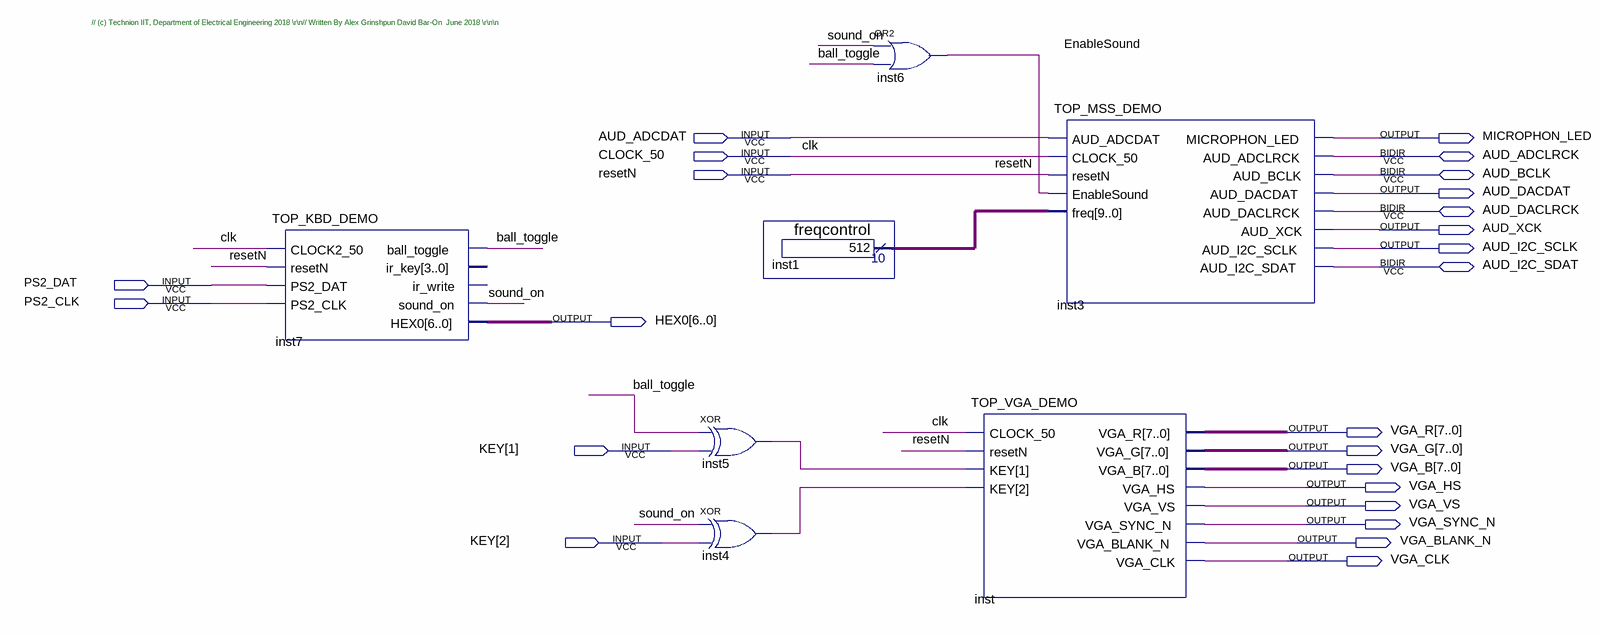
[diagram p0: schematic sheet]
// Quartus schematic TOP_Lab1_DEMO.bdf as structural Verilog: 7 symbols, 24 pins
module TOP_Lab1_DEMO (
  input  AUD_ADCDAT,
  input  CLOCK_50,
  input  resetN,
  input  PS2_DAT,
  input  PS2_CLK,
  input  [2:1] KEY,
  inout  AUD_ADCLRCK,
  inout  AUD_BCLK,
  inout  AUD_DACLRCK,
  inout  AUD_I2C_SDAT,
  output MICROPHON_LED,
  output AUD_DACDAT,
  output AUD_XCK,
  output AUD_I2C_SCLK,
  output [6:0] HEX0,
  output [7:0] VGA_R,
  output [7:0] VGA_G,
  output [7:0] VGA_B,
  output VGA_HS,
  output VGA_VS,
  output VGA_SYNC_N,
  output VGA_BLANK_N,
  output VGA_CLK
);

  wire ball_toggle, EnableSound, inst4_out, inst5_out, sound_on;
  wire [9:0] inst1_result;

  TOP_KBD_DEMO inst7 (
    .CLOCK2_50(CLOCK_50), .resetN(resetN), .PS2_DAT(PS2_DAT), .PS2_CLK(PS2_CLK), .ball_toggle(ball_toggle),
    .sound_on(sound_on), .HEX0(HEX0));  // open: ir_key, ir_write
  xor inst5 (inst5_out, ball_toggle, KEY[1]);
  xor inst4 (inst4_out, sound_on, KEY[2]);
  freqcontrol inst1 (.result(inst1_result));
  or inst6 (EnableSound, sound_on, ball_toggle);
  TOP_VGA_DEMO inst (
    .CLOCK_50(CLOCK_50), .resetN(resetN), .KEY({inst4_out, inst5_out}), .VGA_R(VGA_R), .VGA_G(VGA_G),
    .VGA_B(VGA_B), .VGA_HS(VGA_HS), .VGA_VS(VGA_VS), .VGA_SYNC_N(VGA_SYNC_N), .VGA_BLANK_N(VGA_BLANK_N),
    .VGA_CLK(VGA_CLK));
  TOP_MSS_DEMO inst3 (
    .AUD_ADCDAT(AUD_ADCDAT), .CLOCK_50(CLOCK_50), .resetN(resetN), .EnableSound(EnableSound),
    .freq(inst1_result), .MICROPHON_LED(MICROPHON_LED), .AUD_DACDAT(AUD_DACDAT), .AUD_XCK(AUD_XCK),
    .AUD_I2C_SCLK(AUD_I2C_SCLK), .AUD_ADCLRCK(AUD_ADCLRCK), .AUD_BCLK(AUD_BCLK), .AUD_DACLRCK(AUD_DACLRCK),
    .AUD_I2C_SDAT(AUD_I2C_SDAT));

  // Other names for the same wires on the sheet: clk = CLOCK_50

  // Notes on the sheet:
  //   // (c) Technion IIT, Department of Electrical Engineering 2018 \r\n// Written By Alex Grinshpun David Bar-On  June 2018 \r\n\n
endmodule
